# EAGLE design IMU (EAGLE 7.1.0)
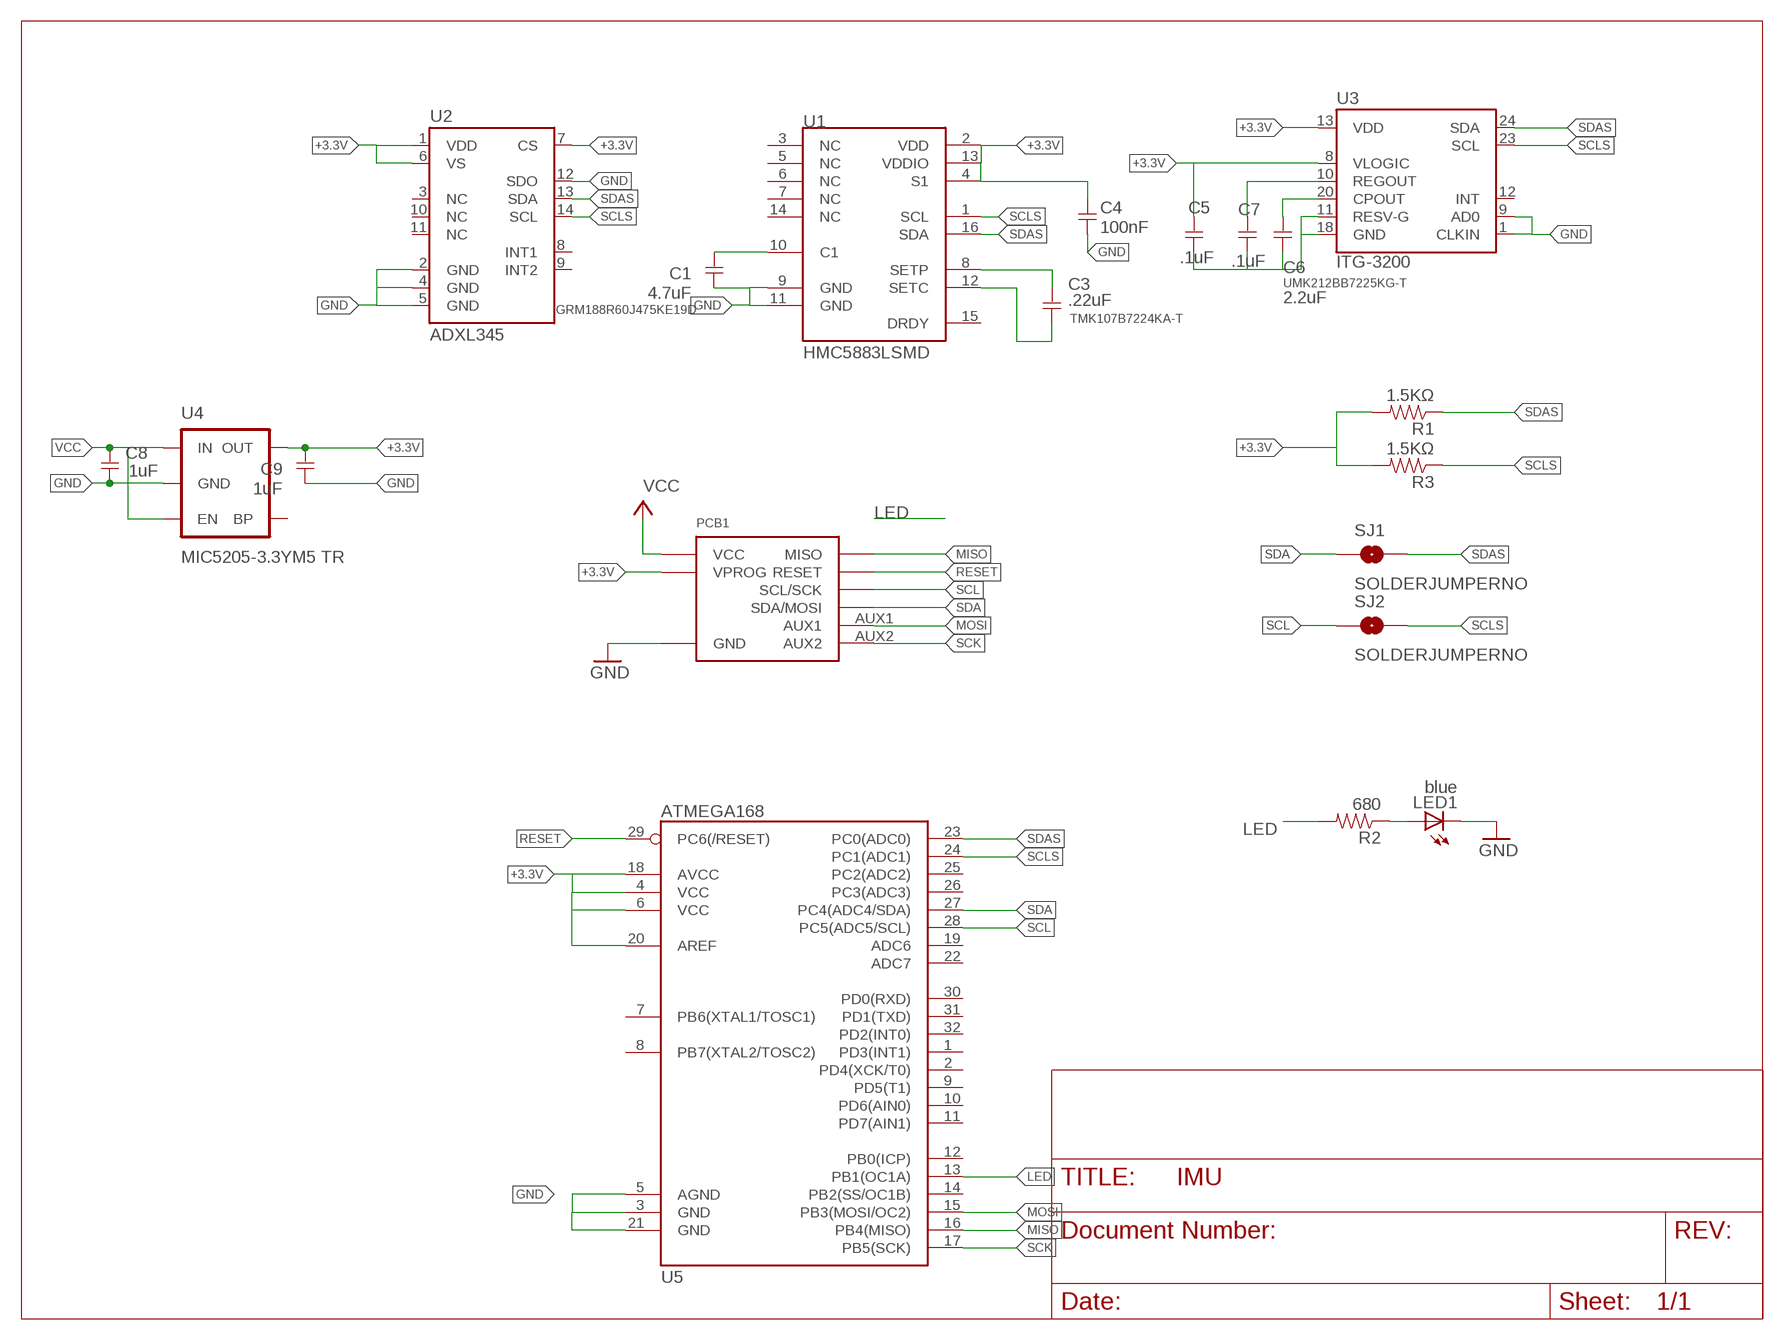
[diagram p0: schematic, sheet 1]

## Parts
C1  4.7uF  CAPACITOR-1UF  [0603]
C3  .22uF  CAPACITOR-1UF  [0603]
C4  100nF  CAPACITOR-100NF  [0603]
C5  .1uF  CAPACITOR-100NF  [0603]
C6  2.2uF  CAPACITOR  [0805]
C7  .1uF  CAPACITOR-100NF  [0603]
C8  1uF  CAPACITOR-1UF  [0603]
C9  1uF  CAPACITOR-1UF  [0603]
LED1  blue  LED-0805-BLUE  [0805-LED]
PCB1  MAGDEVICE-V2  [MAGDEVICE-V2]
R1  1.5KΩ  RESISTOR-1.5KΩ  [0603]
R2  680  RESISTOR  [0805]
R3  1.5KΩ  RESISTOR-1.5KΩ  [0603]
SJ1  SOLDERJUMPERNO  [SJ_2S-NO]
SJ2  SOLDERJUMPERNO  [SJ_2S-NO]
U1  HMC5883LSMD  [16LPCC]
U2  ADXL345  [LGA14]
U3  ITG-3200  [QFN-24]
U4  MIC5205-3.3YM5 TR  VREG-MIC5205-3.3V  [SOT23-5]
U5  ATMEGA168  [TQFP32-08]

## Nets
+3.3V: C4.2 C5.2 C9.2 PCB1.VPROG R1.2 R3.2 U1.2(VDD) U1.4(S1) U1.13(VDDIO) U2.1(VDD) U2.6(VS) U2.7(CS) U3.8(VLOGIC) U3.13(VDD) U4.5(OUT) U5.4(VCC) U5.6(VCC) U5.18(AVCC) U5.20(AREF)
GND: C1.1 C4.1 C8.1 C9.1 LED1.C PCB1.GND U1.9(GND) U1.11(GND) U2.2(GND) U2.4(GND) U2.5(GND) U2.12(SDO) U3.1(CLKIN) U3.9(AD0) U4.2(GND) U5.3(GND) U5.5(AGND) U5.21(GND)
LED: R2.2 U5.13(PB1(OC1A))
MISO: PCB1.MISO U5.16(PB4(MISO))
MOSI: PCB1.AUX1 U5.15(PB3(MOSI/OC2))
N$1: C1.2 U1.10(C1)
N$2: C3.2 U1.8(SETP)
N$3: C3.1 U1.12(SETC)
N$4: C5.1 C6.1 C7.1 U3.11(RESV-G) U3.18(GND)
N$5: C6.2 U3.20(CPOUT)
N$6: C7.2 U3.10(REGOUT)
N$7: LED1.A R2.1
RESET: PCB1.RESET U5.29(PC6(/RESET))
SCK: PCB1.AUX2 U5.17(PB5(SCK))
SCL: PCB1.SCL(SCL/SCK) SJ2.1 U5.28(PC5(ADC5/SCL))
SCLS: R3.1 SJ2.2 U1.1(SCL) U2.14(SCL) U3.23(SCL) U5.24(PC1(ADC1))
SDA: PCB1.SDA(SDA/MOSI) SJ1.1 U5.27(PC4(ADC4/SDA))
SDAS: R1.1 SJ1.2 U1.16(SDA) U2.13(SDA) U3.24(SDA) U5.23(PC0(ADC0))
VCC: C8.2 PCB1.VCC U4.1(IN) U4.3(EN)
Unconnected: U1.3(NC) U1.5(NC) U1.6(NC) U1.7(NC) U1.14(NC) U1.15(DRDY) U2.3(NC) U2.8(INT1) U2.9(INT2) U2.10(NC) U2.11(NC) U3.12(INT) U4.4(BP) U5.1(PD3(INT1)) U5.2(PD4(XCK/T0)) U5.7(PB6(XTAL1/TOSC1)) U5.8(PB7(XTAL2/TOSC2)) U5.9(PD5(T1)) U5.10(PD6(AIN0)) U5.11(PD7(AIN1)) U5.12(PB0(ICP)) U5.14(PB2(SS/OC1B)) U5.19(ADC6) U5.22(ADC7) U5.25(PC2(ADC2)) U5.26(PC3(ADC3)) U5.30(PD0(RXD)) U5.31(PD1(TXD)) U5.32(PD2(INT0))

## Library data of the parts
C1 = Modulo:CAPACITOR: Capacitor; PARTNUM: GRM188R60J475KE19D; VALUE: 1uF
C3 = Modulo:CAPACITOR: Capacitor; PARTNUM: TMK107B7224KA-T; VALUE: 1uF
C4 = Modulo:CAPACITOR: Capacitor; PARTNUM: C0603C104K5RACTU
C5 C7 = Modulo:CAPACITOR: Capacitor; PARTNUM: C0603C104K5RACTU; VALUE: 100nF
C6 = Modulo:CAPACITOR: Capacitor; PARTNUM: UMK212BB7225KG-T
C8 C9 = Modulo:CAPACITOR: Capacitor; PARTNUM: C0603C105K4RACTU
LED1 = Modulo:LED: LED; PARTNUM: LTST-C171TBKT
PCB1 = Modulo:MAGDEVICE
R1 R3 = Modulo:RESISTOR: Resistor Basic schematic elements and footprints for 0603, 1206, and PTH resistors.; PARTNUM: ERJ-3EKF1501V
R2 = Modulo:RESISTOR: Resistor Basic schematic elements and footprints for 0603, 1206, and PTH resistors.
SJ1 SJ2 = SparkFun-Passives:SOLDERJUMPER: Solder Jumper Standard SMD solder jumper. Used to automate production. Two varients : Normally Open and Normally Closed are the same, but have different paste layers. NC will have a large amount of paste and should jumper during reflow.
U1 = SparkFun-Sensors:HMC5883L: 3 Axis Digital Compass IC
U2 = SparkFun-Sensors:ADXL345: 3-axis SPI/I2C 2/4/8/16g accelerometer
U3 = SparkFun-Sensors:ITG-3200: ITG-3200 3-axis gyro, digital output, qfn24 package
U4 = Modulo:VREG-MIC5205: V_REG MIC5219 Standard 3.3V and 5V 150mA LDO voltage regulator in SOT-23 layout. Micrel part MIC5205. BP (by-pass) pin is used to lower output noise with 470pF cap, may be left open.
U5 = SparkFun-DigitalIC:ATMEGA168: Atmel 32-pin 8-bit micro, 16k flash.

## Board
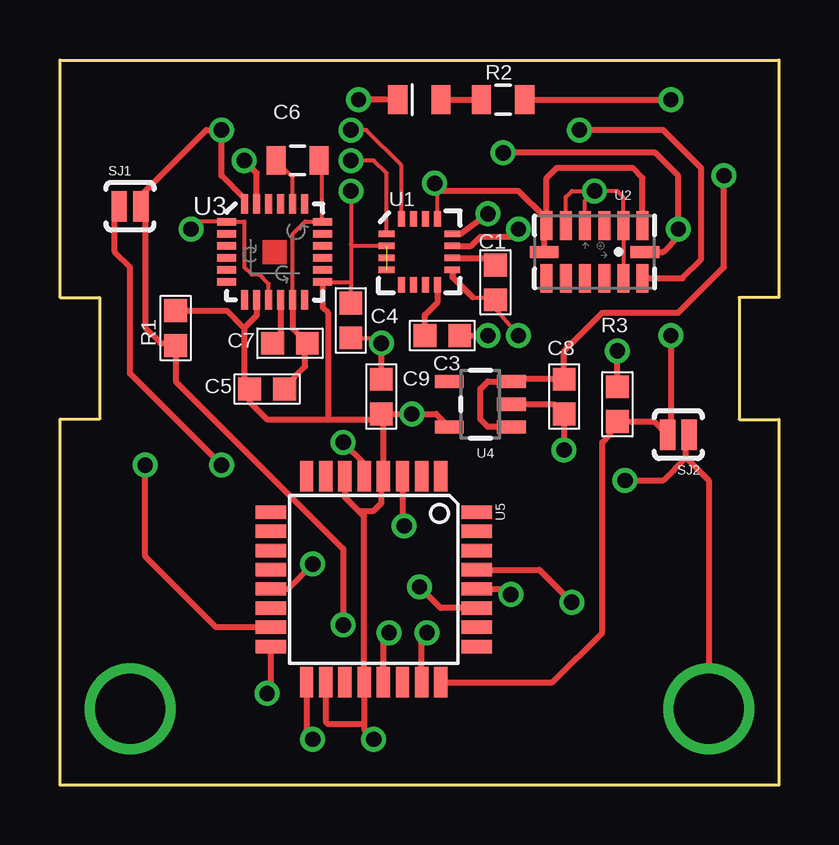
[diagram p1: board, top side]
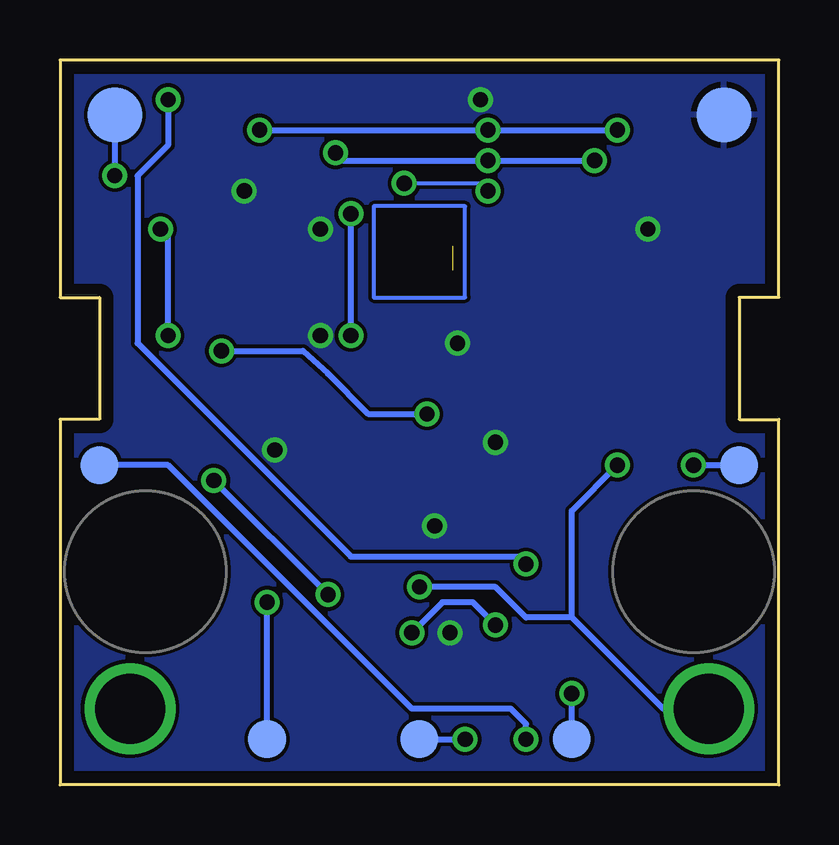
[diagram p2: board, bottom side, seen from below]

Size 29.97 x 30.23 mm. Coordinates in mm from the lower left corner, seen from the top.
Copper layers (1*16): Top 0.0178mm / dielectric 59mil / Bottom 0.0178mm
Design rules "SSC-EAGLE-2Lyr_v1.0.0.3 *": minimum track width 6mil, minimum drill 14mil, track to track 6mil, track to pad 6mil, pad to pad 6mil, via to via 6mil, smd to smd 6mil, copper to edge 20mil, drill to drill 16mil, minimum pad ring 8mil, minimum via ring 8mil, stop-mask expansion 3mil, vias tented up to drill 25mil, thermal gap 10mil

### Footprints (pad centres in the part's own frame; a part is rotated, then mirrored left to right if it is on the bottom)
0603 = smd 0.95 x 0.95: 1 -0.725,0; 2 0.725,0
0805 = smd 0.8 x 1.2: 1 -0.9,0; 2 0.9,0
0805-LED = smd 1.2 x 0.8: A 0,-0.9; C 0,0.9
MAGDEVICE-V2 = smd 1.587 x 1.587 bottom: AUX1 1.905,13.335; AUX2 28.575,13.335; MISO 8.89,1.905; RESET 21.59,1.905; VPROG 15.24,1.905 | smd 2.286 x 2.286 bottom: GND 2.54,27.94; VCC 27.94,27.94 | drill 2.921: SCL 27.305,3.175; SDA 3.175,3.175
SJ_2S-NO = smd 0.635 x 1.27: 1 -0.45,0; 2 0.45,0
16LPCC = smd 0.65 x 0.28: 1 -1.37,0.75; 2 -1.37,0.25; 3 -1.37,-0.25; 4 -1.37,-0.75; 9 1.37,-0.75; 10 1.37,-0.25; 11 1.37,0.25; 12 1.37,0.75 | smd 0.28 x 0.65: 5 -0.75,-1.37; 6 -0.25,-1.37; 7 0.25,-1.37; 8 0.75,-1.37; 13 0.75,1.37; 14 0.25,1.37; 15 -0.25,1.37; 16 -0.75,1.37
LGA14 = smd 0.5 x 1.2: 1 2,1.1; 2 1.2,1.1; 3 0.4,1.1; 4 -0.4,1.1; 5 -1.2,1.1; 6 -2,1.1; 8 -2,-1.1; 9 -1.2,-1.1; 10 -0.4,-1.1; 11 0.4,-1.1; 12 1.2,-1.1; 13 2,-1.1 | smd 1.2 x 0.5: 7 -2.1,0; 14 2.1,0
QFN-24 = smd 0.8 x 0.3: 1 -2,1.25; 2 -2,0.75; 3 -2,0.25; 4 -2,-0.25; 5 -2,-0.75; 6 -2,-1.25; 13 2,-1.25; 14 2,-0.75; 15 2,-0.25; 16 2,0.25; 17 2,0.75; 18 2,1.25 | smd 0.3 x 0.8: 7 -1.25,-2; 8 -0.75,-2; 9 -0.25,-2; 10 0.25,-2; 11 0.75,-2; 12 1.25,-2; 19 1.25,2; 20 0.75,2; 21 0.25,2; 22 -0.25,2; 23 -0.75,2; 24 -1.25,2
SOT23-5 = smd 0.55 x 1.2: 1 -0.95,-1.3; 2 0,-1.3; 3 0.95,-1.3; 4 0.95,1.3; 5 -0.95,1.3
TQFP32-08 = smd 1.27 x 0.559: 1 -4.293,2.8; 2 -4.293,2; 3 -4.293,1.2; 4 -4.293,0.4; 5 -4.293,-0.4; 6 -4.293,-1.2; 7 -4.293,-2; 8 -4.293,-2.8; 17 4.293,-2.8; 18 4.293,-2; 19 4.293,-1.2; 20 4.293,-0.4; 21 4.293,0.4; 22 4.293,1.2; 23 4.293,2; 24 4.293,2.8 | smd 0.559 x 1.27: 9 -2.8,-4.293; 10 -2,-4.293; 11 -1.2,-4.293; 12 -0.4,-4.293; 13 0.4,-4.293; 14 1.2,-4.293; 15 2,-4.293; 16 2.8,-4.293; 25 2.8,4.293; 26 2,4.293; 27 1.2,4.293; 28 0.4,4.293; 29 -0.4,4.293; 30 -1.2,4.293; 31 -2,4.293; 32 -2.8,4.293

### Placement (x,y rotation side)
C1  18.16,20.95 90 top
C3  15.94,18.73 180 top
C4  12.13,19.37 90 top
C5  8.64,16.51 180 top
C6  9.91,26.04 180 top
C7  9.59,18.41 180 top
C8  21.02,16.19 90 top
C9  13.4,16.19 270 top
LED1  14.99,28.57 90 top
PCB1  -0.25,0 0 top
R1  4.83,19.05 90 top
R2  18.48,28.57 0 top
R3  23.24,15.88 90 top
SJ1  2.92,24.13 0 top
SJ2  25.78,14.61 180 top
U1  14.99,22.23 0 top
U2  22.29,22.23 0 top
U3  8.95,22.23 0 top
U4  17.53,15.88 90 top
U5  13.08,8.57 270 top

### Tracks (layer width: path | path; a pad name or v marks a point on that pad's centre or on a via)
+3.3V  (via drill 0.64)  (1 unrouted)
  Top 0.159: U3.13 12.15,20.98 12.13,20.68 | C4.2 12.13,20.68 | U1.2 12.2,22.48 12.13,22.54 | v12.13,24.77 12.13,22.54 | 12.13,22.54 12.13,20.68 | U1.13 15.74,24.97 v15.62,25.08 15.85,24.77
  Top 0.254: U3.8 8.2,19.57 7.68,19.05 | 7.68,19.05 7.68,16.74 C5.2 7.91,15.96 8.64,15.24 11.18,15.24 | U2.1 24.29,25.3 23.88,25.72 20.7,25.72 20.29,25.3 U2.6 20.19,23.23 | U2.7 20.19,23.23 | 20.19,23.23 20.19,23.69 19.11,24.77 15.85,24.77 | C9.2 v14.67,15.47 15.68,15.47 U4.5 | R3.2 v23.24,18.1 | 11.18,15.24 13.17,15.24 C9.2 | U3.13 10.95,19.91 11.18,19.68 11.18,15.24 | R1.2 6.96,19.77 7.68,19.05 | U5.6 11.88,11.99 12.45,11.43 | 12.45,11.43 13.08,11.43 13.4,11.75 13.4,12.78 U5.4 13.48,15.38 C9.2 | 12.68,2.54 U5.20 12.68,11.2 12.45,11.43 | 12.68,2.54 12.68,2.31 v13.08,1.91 | U5.18 11.08,2.63 11.18,2.54 12.68,2.54
  Bottom 0.159: v15.62,25.08 12.45,25.08 v12.13,24.77
  Bottom 0.254: v23.24,18.1 19.84,18.1 18.8,17.14 17.12,15.47 v14.67,15.47 | PCB1.VPROG v13.08,1.91
GND  (via drill 0.64)
  Top 0.159: v5.46,23.18 5.78,23.5 6.97,23.5 7.68,23.5 7.68,21.59 8,21.27 8.32,21.27 8.7,20.89 U3.9 | 17.75,20.32 v19.11,18.73 | 17.21,20.32 18.07,20.32 C1.1 | U2.5 21.09,24.52 21.34,24.77 v22.29,24.77 | U2.4 21.89,24.36 v22.29,24.77 | v22.29,24.77 23.24,24.77 23.49,24.52 U2.2 U2.12 | C4.1 13.17,18.64 v13.4,18.41
  Top 0.254: U1.9 16.36,21.17 17.21,20.32 | 17.75,20.32 C1.1 | U1.11 17.14,22.48 17.53,22.86 18.8,22.86 v19.11,23.18 | LED1.C v12.45,28.57 | U4.2 20.61,15.88 C8.1 v21.02,13.97 | C9.1 v13.4,18.41 | U5.5 12.68,13.42 v11.81,14.29 | U5.3 14.28,10.87 v14.35,10.79 | U5.21 13.48,6.12 v13.72,6.35 | 6.97,23.5 U3.1
  pour Bottom: -0.25,0 -0.25,30.48 30.23,30.48 30.23,0
LED  (via drill 0.64)
  Top 0.254: R2.2 v25.46,28.57 | U5.13 9.51,8.17 v10.54,9.21
  Bottom 0.254: v25.46,28.57 25.46,26.67 26.73,25.4 26.73,18.41 17.84,9.53 10.86,9.53 v10.54,9.21
MISO  (via drill 0.64)
  Top 0.254: U5.16 8.79,3.96 v8.64,3.81
  Bottom 0.254: PCB1.MISO v8.64,3.81
MOSI  (via drill 0.64)
  Top 0.254: U5.15 6.51,6.57 3.56,9.53 v3.56,13.34
  Bottom 0.254: v3.56,13.34 PCB1.AUX1
N$1
  Top 0.254: U1.10 17.87,21.98 C1.2
N$2
  Top 0.254: C3.2 15.21,19.59 15.74,20.12 U1.8
N$3  (via drill 0.64)
  Top 0.254: C3.1 v17.84,18.73 | U1.12 16.69,22.98 v17.84,23.81
  Bottom 0.254: v17.84,18.73 v17.84,23.81
N$4
  Top 0.159: C6.1 10.93,25.91 10.93,23.5 10.22,23.5 9.7,22.98 U3.11
  Top 0.254: 10.93,23.5 U3.18 | U3.11 9.7,19.02 C7.1 10.22,18.32 10.22,17.46 9.36,16.6 C5.1
N$5
  Top 0.159: U3.20 9.7,25.34 C6.2
N$6
  Top 0.254: U3.10 9.2,18.75 C7.2
N$7
  Top 0.254: LED1.A R2.1
N$8
  Bottom 0.159: 13.08,20.32 13.08,24.13 16.89,24.13 16.89,20.32 13.08,20.32
RESET  (via drill 0.64)
  Top 0.254: U5.29 19.98,8.97 v21.34,7.62
  Bottom 0.254: PCB1.RESET v21.34,7.62
SCK  (via drill 0.64)
  Top 0.254: U5.17 10.28,2.28 v10.54,1.91
  Bottom 0.254: v10.54,1.91 10.54,2.54 11.18,3.17 15.3,3.17 25.46,13.34 PCB1.AUX2
SCL  (via drill 0.64)
  Top 0.254: PCB1.SCL 27.05,12.7 26.1,13.65 | 26.1,13.65 26.1,14.47 SJ2.1 | U5.28 18.88,8.17 v18.8,7.94 | v23.56,12.7 25.15,12.7 26.1,13.65
  Bottom 0.254: v18.8,7.94 v23.56,12.7
SCLS  (via drill 0.64)
  Top 0.159: U1.1 13.62,25.5 13.08,26.04 v12.13,26.04
  Top 0.254: U2.14 25.15,22.23 25.78,22.86 v25.78,23.18 25.78,25.4 24.83,26.35 v18.48,26.35 | U3.23 8.2,25.52 v7.68,26.04 | 23.15,14.92 R3.1 | v25.46,18.73 25.46,14.74 SJ2.2 24.79,15.15 R3.1 | U5.24 20.54,4.28 22.61,6.35 22.61,14.29 22.92,14.61 R3.1
  Bottom 0.254: v18.48,26.35 18.16,26.04 v12.13,26.04 v7.68,26.04 | v25.46,18.73 25.46,22.86 v25.78,23.18
SDA  (via drill 0.64)
  Top 0.254: U5.27 15.87,7.37 v14.99,8.26 | v6.73,13.34 2.92,17.14 2.92,21.59 2.29,22.23 2.29,23.95 SJ1.1
  Bottom 0.254: PCB1.SDA 4.83,3.17 8.64,6.99 | 8.64,6.99 10.54,6.99 11.81,8.26 v14.99,8.26 | 8.64,6.99 8.64,11.43 v6.73,13.34
SDAS  (via drill 0.64)
  Top 0.159: U1.16 14.24,25.83 12.76,27.3 v12.13,27.3
  Top 0.254: U2.13 25.95,21.12 26.73,21.91 26.73,25.72 25.15,27.3 v21.65,27.3 | U3.24 7.7,24.43 6.73,25.4 v6.73,27.3 6.1,27.3 3.42,24.63 SJ1.2 3.42,23.68 3.56,23.5 3.56,19.05 4.19,18.41 4.74,18.41 R1.1 4.83,16.83 11.81,9.84 v11.81,6.67 | U5.23 15.08,6.13 v15.3,6.35
  Bottom 0.254: v21.65,27.3 v12.13,27.3 v6.73,27.3 | v11.81,6.67 12.76,7.62 14.03,7.62 v15.3,6.35
VCC  (via drill 0.64)
  Top 0.254: v27.69,25.4 27.69,21.59 25.78,19.68 22.61,19.68 21.02,18.1 C8.2 18.92,16.92 U4.3 17.84,16.83 17.53,16.51 17.53,15.24 17.84,14.93 U4.1
  Bottom 0.254: PCB1.VCC v27.69,25.4